# Altium schematic sheet [16] - CTRL MOTOR.SchDoc
size A3; DocumentNumber: 16; SheetNumber: 16; SheetTotal: 18
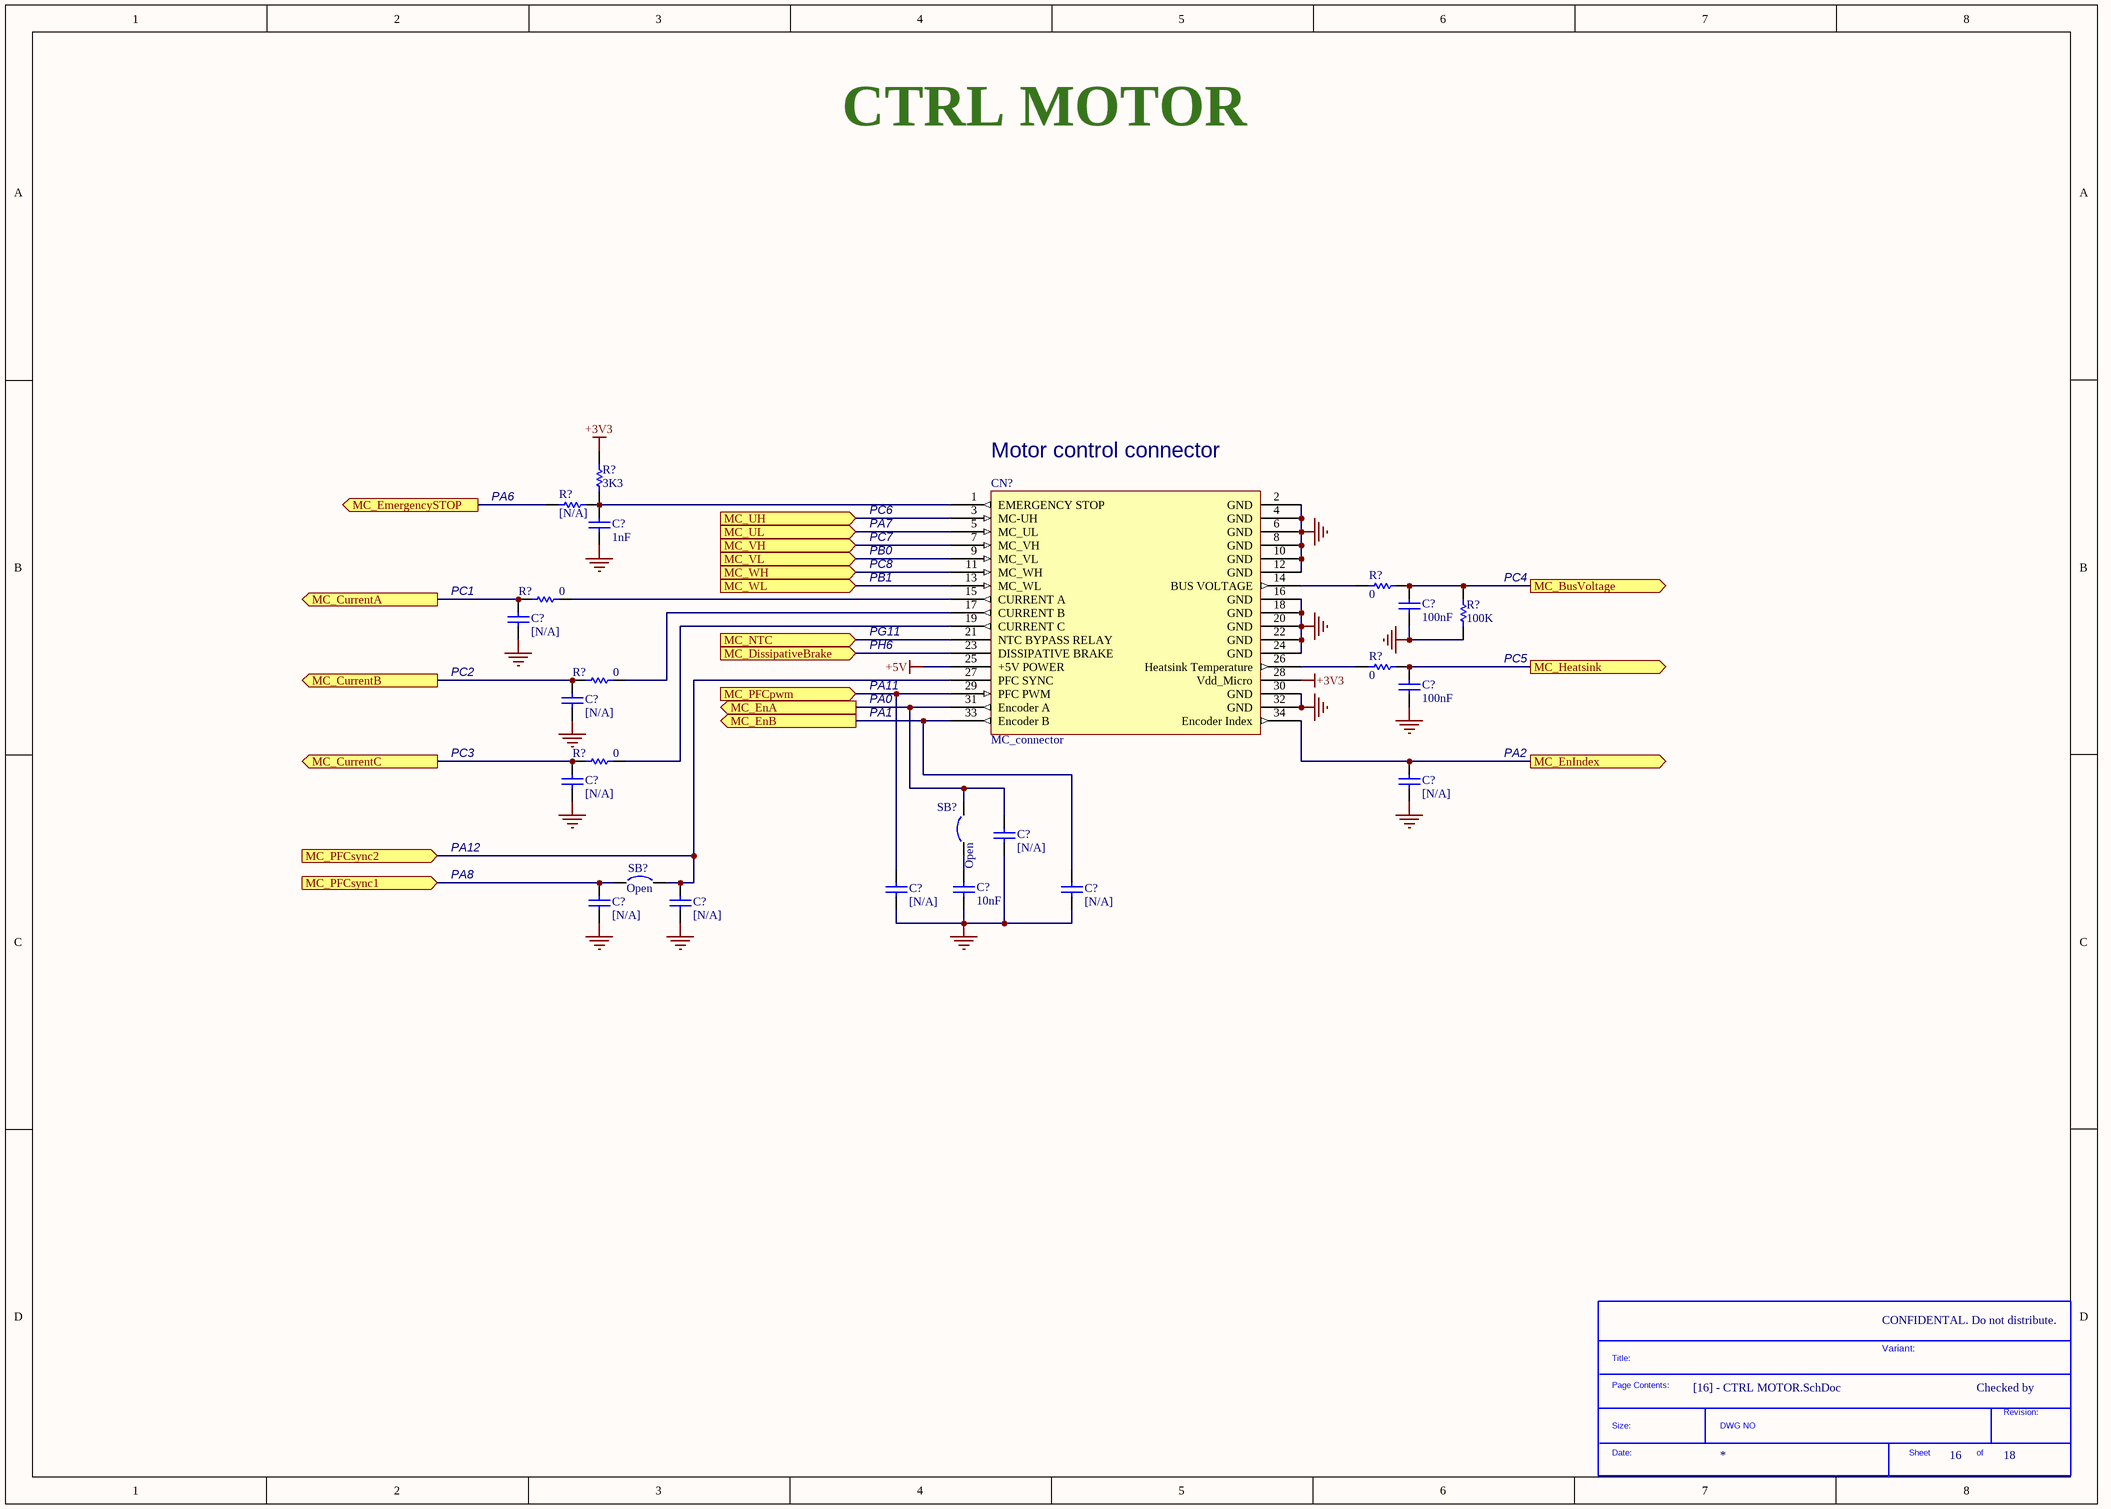
[diagram p0: [16] - CTRL MOTOR.SchDoc]

## Parts
(Parts that share a designator on the sheet are numbered #1, #2 ... from top to bottom, then left to right.)
*  SDTitleBlock  (value not drawn)  (graphical)
C?#1  1nF  [0603C]
C?#2  100nF  [0603C]
C?#3  [N/A]  [0603C]
C?#4  100nF  [0603C]
C?#5  [N/A]  [0603C]
C?#6  [N/A]  [0603C]
C?#7  [N/A]  [0603C]
C?#8  [N/A]  [0603C]
C?#9  10nF  [0603C]
C?#10  [N/A]  [0603C]
C?#11  [N/A]  [0603C]
C?#12  [N/A]  [0603C]
C?#13  [N/A]  [0603C]
CN?  MC_connector  [IDC34S]
R?#1  3K3  [0603R]
R?#2  [N/A]  [0603R]
R?#3  0  [0603R]
R?#4  0  [0603R]
R?#5  100K  [0603R]
R?#6  0  [0603R]
R?#7  0  [0603R]
R?#8  0  [0603R]
SB?#1  Open  [SB_0603]
SB?#2  Open  [SB_0603]

## Ports
MC_BusVoltage (out), MC_CurrentA (out), MC_CurrentB (out), MC_CurrentC (out), MC_DissipativeBrake (in), MC_EmergencySTOP (out), MC_EnA (out), MC_EnB (out), MC_EnIndex (out), MC_Heatsink (out), MC_NTC (in), MC_PFCpwm (in), MC_PFCsync1 (in), MC_PFCsync2 (in), MC_UH (in), MC_UL (in), MC_VH (in), MC_VL (in), MC_WH (in), MC_WL (in)

## Nets
+3V3: CN?.28(Vdd_Micro) R?#1.2
+5V: CN?.25(+5V_POWER)
GND: C?#1.1 C?#2.2 C?#3.1 C?#4.2 C?#5.1 C?#6.1 C?#7.1 C?#8.1 C?#9.2 C?#10.1 C?#11.1 C?#12.1 C?#13.1 CN?.2(GND) CN?.4(GND) CN?.6(GND) CN?.8(GND) CN?.10(GND) CN?.12(GND) CN?.16(GND) CN?.18(GND) CN?.20(GND) CN?.22(GND) CN?.24(GND) CN?.30(GND) CN?.32(GND) R?#5.2
MC_BusVoltage: C?#2.1 R?#3.2 R?#5.1 ; port MC_BusVoltage
MC_CurrentA: C?#3.2 R?#4.1 ; port MC_CurrentA
MC_CurrentB: C?#5.2 R?#7.1 ; port MC_CurrentB
MC_CurrentC: C?#6.2 R?#8.1 ; port MC_CurrentC
MC_DissipativeBrake: CN?.23(DISSIPATIVE_BRAKE) ; port MC_DissipativeBrake
MC_EmergencySTOP: R?#2.2 ; port MC_EmergencySTOP
MC_EnA: C?#8.2 CN?.31(Encoder_A) SB?#1.2 ; port MC_EnA
MC_EnB: C?#11.2 CN?.33(Encoder_B) ; port MC_EnB
MC_EnIndex: C?#7.2 CN?.34(Encoder_Index) ; port MC_EnIndex
MC_Heatsink: C?#4.1 R?#6.2 ; port MC_Heatsink
MC_NTC: CN?.21(NTC_BYPASS_RELAY) ; port MC_NTC
MC_PFCpwm: C?#10.2 CN?.29(PFC_PWM) ; port MC_PFCpwm
MC_PFCsync1: C?#12.2 SB?#2.1 ; port MC_PFCsync1
MC_PFCsync2: C?#13.2 CN?.27(PFC_SYNC) SB?#2.2 ; port MC_PFCsync2
MC_UH: CN?.3(MC-UH) ; port MC_UH
MC_UL: CN?.5(MC_UL) ; port MC_UL
MC_VH: CN?.7(MC_VH) ; port MC_VH
MC_VL: CN?.9(MC_VL) ; port MC_VL
MC_WH: CN?.11(MC_WH) ; port MC_WH
MC_WL: CN?.13(MC_WL) ; port MC_WL
NetC?#1_2: C?#1.2 CN?.1(EMERGENCY_STOP) R?#1.1 R?#2.1
NetC?#9_1: C?#9.1 SB?#1.1
NetCN?_14: CN?.14(BUS_VOLTAGE) R?#3.1
NetCN?_15: CN?.15(CURRENT_A) R?#4.2
NetCN?_17: CN?.17(CURRENT_B) R?#7.2
NetCN?_19: CN?.19(CURRENT_C) R?#8.2
NetCN?_26: CN?.26(Heatsink_Temperature) R?#6.1

## Notes on the sheet
- CTRL MOTOR
- (near R?#2) PA6
- PC6
- (near CN?) Motor control connector
- PA7
- PB0
- PB1
- PC7
- PC8
- (near R?#5) PC4
- PC1
- PG11
- PH6
- PC2
- PA1
- PA0
- PA11
- (near R?#5) PC5
- PC3
- PA2
- PA12
- PA8
- CONFIDENTAL. Do not distribute.
- CLOCKS (CPU & PCIE)
- Variant:
- Checked by
- (in symbol SDTitleBlock) Title:; Page Contents:; Revision:; Size:; DWG NO; Date:; Sheet; of

## Library data of the parts
C?#1 C?#9 = CAP: Capacitor; Value: 100pF; Published: 8-Jun-2000; Revision: July-2002: Re-released for DXP Platform.; Publisher: Altium Limited
C?#2 C?#4 = Cap: Capacitor; Value: 10nF; Published: 8-Jun-2000; Revision: July-2002: Re-released for DXP Platform.; Publisher: Altium Limited
C?#3 C?#5-C?#8 C?#10-C?#13 = cap: Capacitor; Value: 100pF; Published: 8-Jun-2000; Revision: July-2002: Re-released for DXP Platform.; Publisher: Altium Limited
R?#1-R?#4 R?#6-R?#8 = Res1: Resistor; Value: 1K; Published: 8-Jun-2000; Revision: July-2002: Re-released for DXP Platform.; Publisher: Altium Limited
R?#5 = res1: Resistor; Value: 1K; Published: 8-Jun-2000; Revision: July-2002: Re-released for DXP Platform.; Publisher: Altium Limited
SB?#1 SB?#2 = Circuit Breaker: Published: 24-Mar-1999; Revision: July-2002: Re-released for DXP Platform.; Publisher: Altium Limited